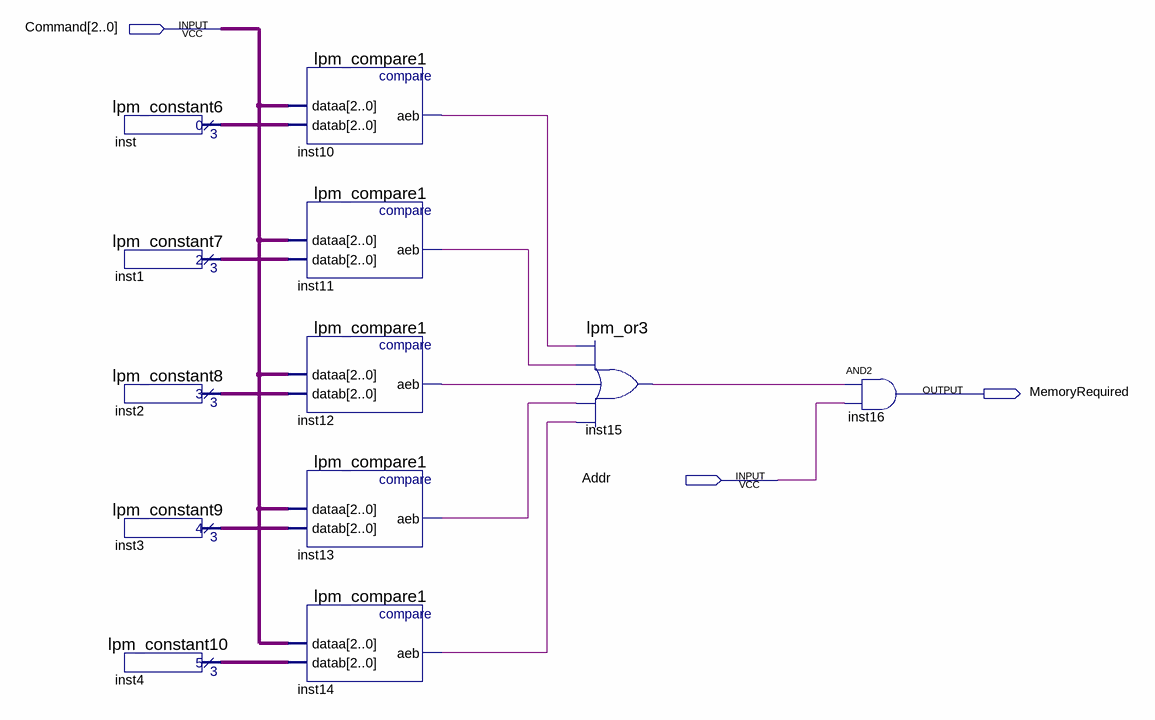
[diagram p0: schematic sheet]
// Quartus schematic MemoryIsRequired.bdf as structural Verilog: 12 symbols, 3 pins
module MemoryIsRequired (
  input  [2:0] Command,
  input  Addr,
  output MemoryRequired
);

  wire inst10_aeb, inst11_aeb, inst12_aeb, inst13_aeb, inst14_aeb, inst15_result;
  wire [2:0] inst1_result, inst2_result, inst3_result, inst4_result, inst_result;

  lpm_constant6 inst (.result(inst_result));
  lpm_constant7 inst1 (.result(inst1_result));
  lpm_constant8 inst2 (.result(inst2_result));
  lpm_constant9 inst3 (.result(inst3_result));
  lpm_constant10 inst4 (.result(inst4_result));
  lpm_compare1 inst10 (.dataa(Command), .datab(inst_result), .aeb(inst10_aeb));
  lpm_compare1 inst11 (.dataa(Command), .datab(inst1_result), .aeb(inst11_aeb));
  lpm_compare1 inst12 (.dataa(Command), .datab(inst2_result), .aeb(inst12_aeb));
  lpm_compare1 inst13 (.dataa(Command), .datab(inst3_result), .aeb(inst13_aeb));
  lpm_compare1 inst14 (.dataa(Command), .datab(inst4_result), .aeb(inst14_aeb));
  lpm_or3 inst15 (
    .data0(inst10_aeb), .data1(inst11_aeb), .data2(inst12_aeb), .data3(inst13_aeb), .data4(inst14_aeb),
    .result(inst15_result));
  and inst16 (MemoryRequired, inst15_result, Addr);
endmodule
